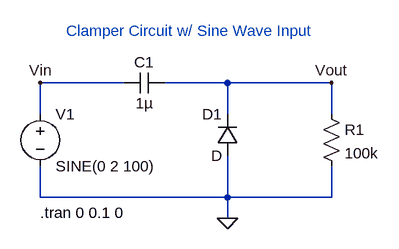
[diagram p0: schematic 2EEB_VELASCO_EXPT4_CKT5.asc]
2EEB_VELASCO_EXPT4_CKT5.asc, the LTspice schematic file:
Version 4
SHEET 1 880 680
WIRE 224 48 96 48
WIRE 384 48 288 48
WIRE 544 48 384 48
WIRE 96 96 96 48
WIRE 384 96 384 48
WIRE 544 96 544 48
WIRE 96 224 96 176
WIRE 384 224 384 160
WIRE 384 224 96 224
WIRE 544 224 544 176
WIRE 544 224 384 224
WIRE 384 256 384 224
FLAG 384 256 0
FLAG 544 48 Vout
FLAG 96 48 Vin
SYMBOL voltage 96 80 R0
SYMATTR InstName V1
SYMATTR Value SINE(0 2 100)
SYMBOL cap 288 32 R90
WINDOW 0 0 32 VBottom 2
WINDOW 3 32 32 VTop 2
SYMATTR InstName C1
SYMATTR Value 1µ
SYMBOL res 528 80 R0
SYMATTR InstName R1
SYMATTR Value 100k
SYMBOL diode 400 160 R180
WINDOW 0 24 64 Left 2
WINDOW 3 24 0 Left 2
SYMATTR InstName D1
TEXT 96 248 Left 2 !.tran 0 0.1 0
TEXT 136 -32 Left 2 ;Clamper Circuit w/ Sine Wave Input

The netlist it stands for:
* 2EEB_VELASCO_EXPT4_CKT5.asc
V1 Vin 0 SINE(0 2 100)
C1 Vout Vin 1µ
R1 Vout 0 100k
D1 0 Vout D
.model D D
.lib standard.dio
.tran 0 0.1 0
* Clamper Circuit w/ Sine Wave Input
.backanno
.end